# Altium schematic sheet mini.SchDoc
size A3
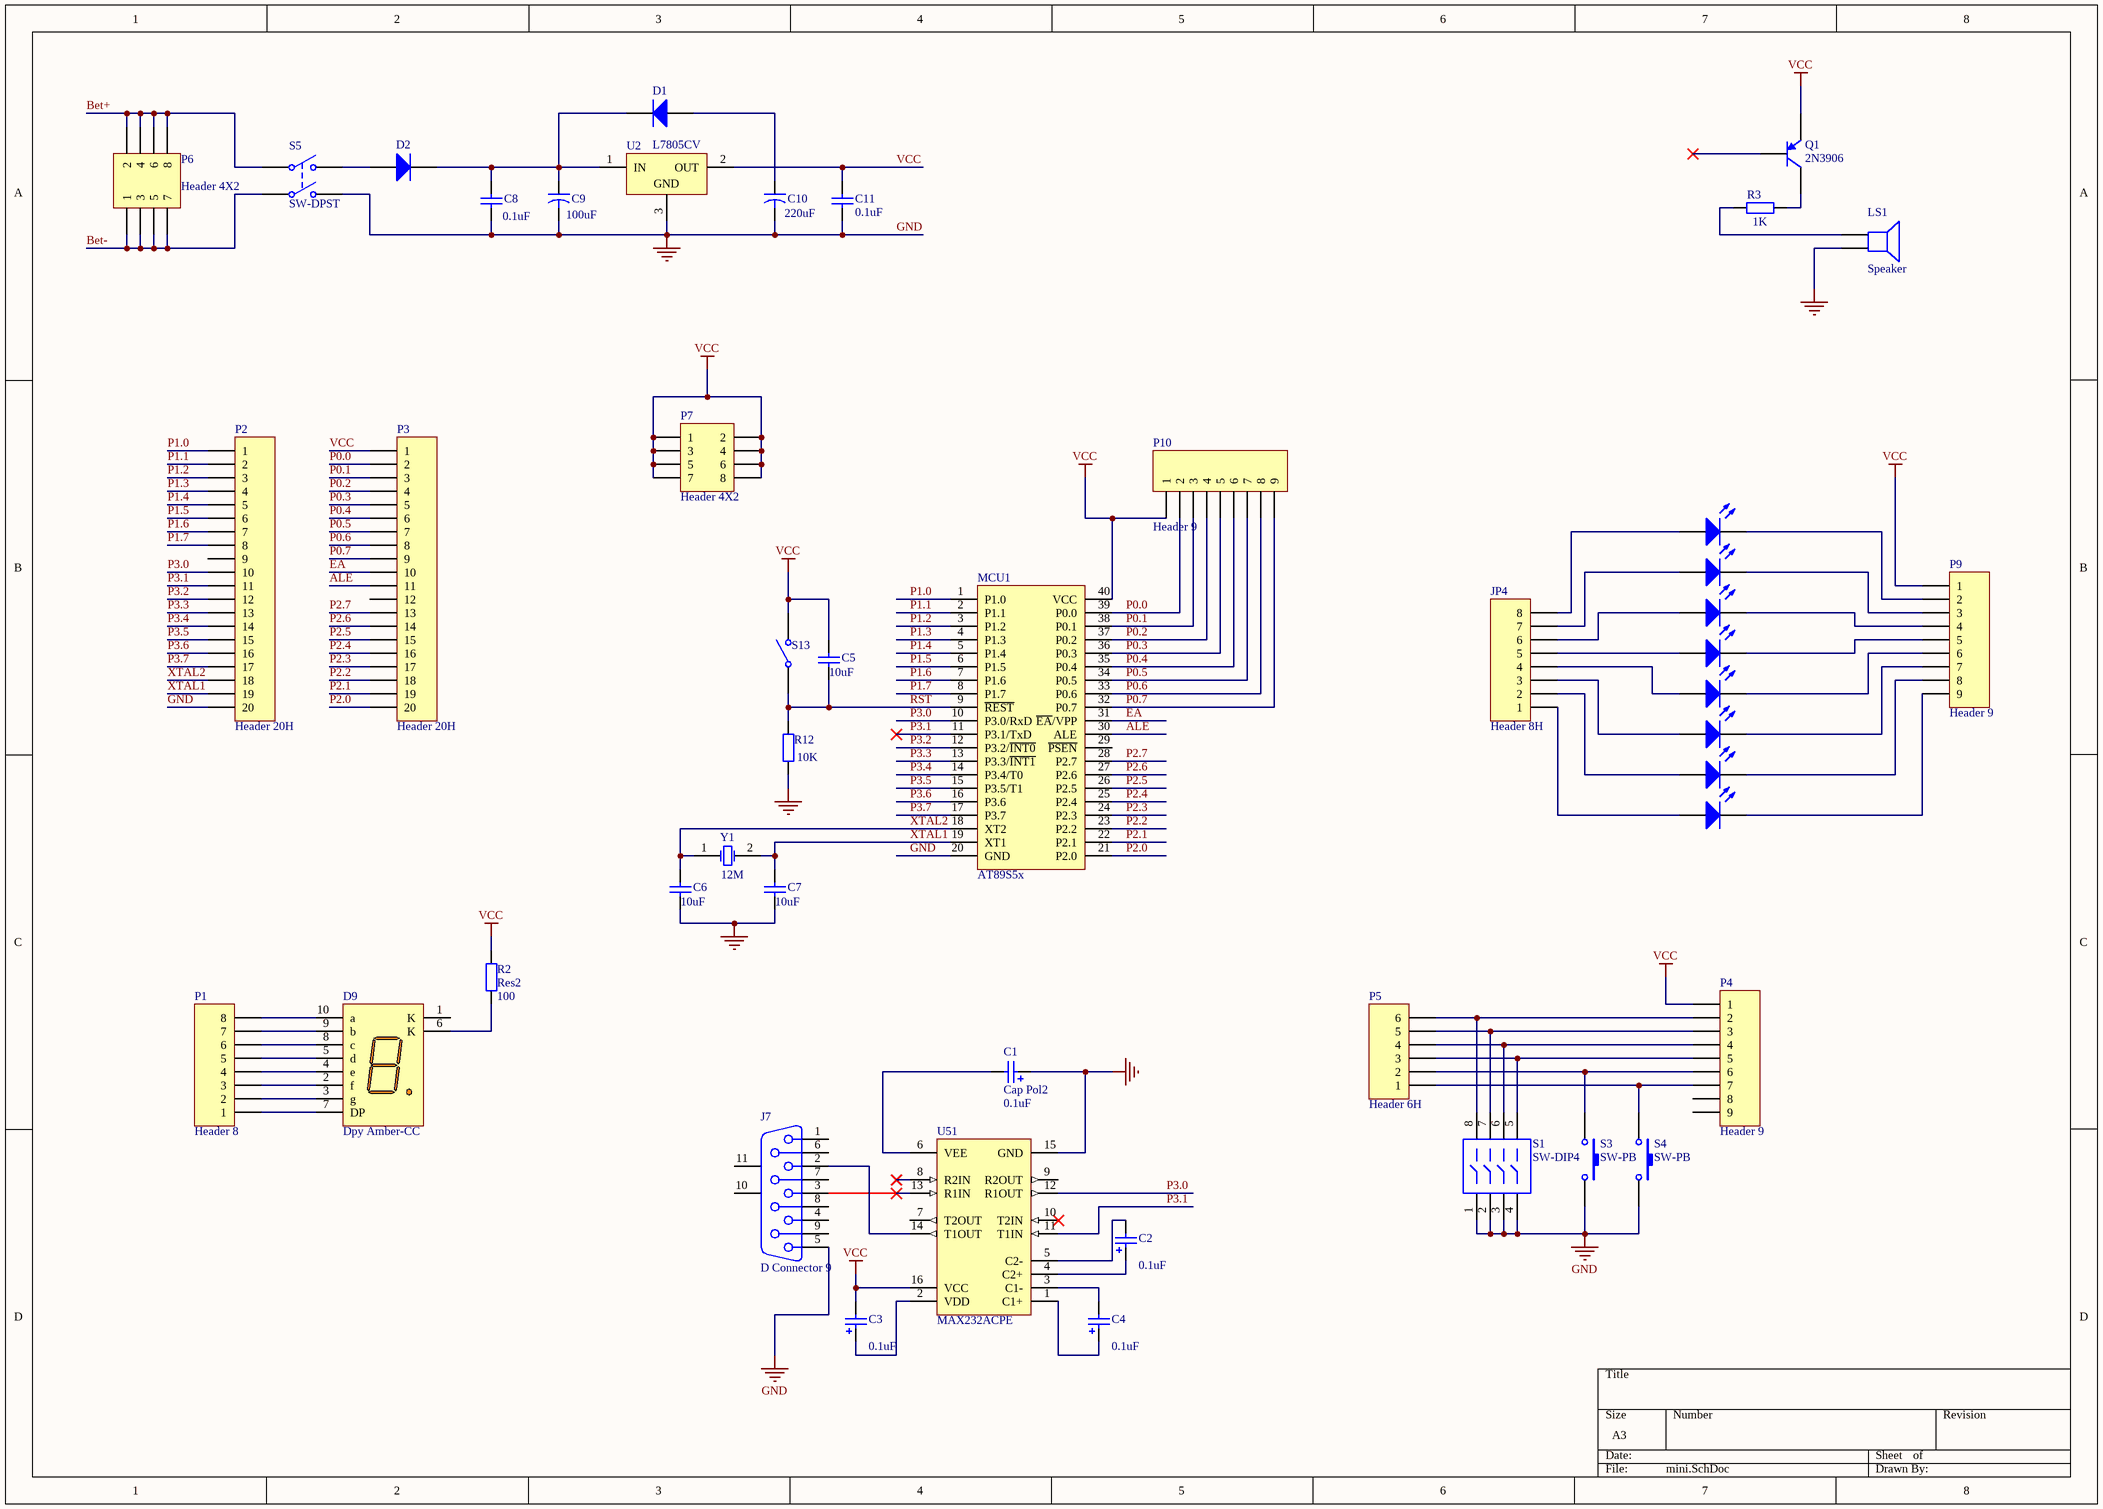
[diagram p0: mini.SchDoc]

## Parts
C1  Cap Pol2  value 0.1uF  [POLAR0.8]
C2  value 0.1uF  [POLAR0.8]  (hidden comment: Cap Pol2)
C3  value 0.1uF  [POLAR0.8]  (hidden comment: Cap Pol2)
C4  value 0.1uF  [POLAR0.8]  (hidden comment: Cap Pol2)
C5  value 10uF  [CC 2.2*5]  (hidden comment: Cap)
C6  value 10uF  [RAD-0.3]  (hidden comment: Cap)
C7  value 10uF  [RAD-0.3]  (hidden comment: Cap)
C8  value 0.1uF  [RAD-0.3]  (hidden comment: Cap)
C9  value 100uF  [CAPR5-4X5]  (hidden comment: Cap2)
C10  value 220uF  [CAPR5-4X5]  (hidden comment: Cap2)
C11  value 0.1uF  [RAD-0.3]  (hidden comment: Cap)
D1  Diode 1N4007  [DIODE-0.4]  (value not drawn)
D2  Diode 1N4148  [DIODE-0.4]  (value not drawn)
D9  Dpy Amber-CC  [H]
DS11  LED0  [PIN2]  (value not drawn)
DS12  LED0  [PIN2]  (value not drawn)
DS13  LED0  [PIN2]  (value not drawn)
DS14  LED0  [PIN2]  (value not drawn)
DS15  LED0  [PIN2]  (value not drawn)
DS16  LED0  [PIN2]  (value not drawn)
DS17  LED0  [PIN2]  (value not drawn)
DS18  LED0  [PIN2]  (value not drawn)
J7  D Connector 9  [DSUB1.385-2H9]
JP4  Header 8H  [HDR1X8H]
LS1  Speaker  [BEEP 7.6X12X7.5]
MCU1  AT89S5x  [DIP40]
P1  Header 8  [HDR1X8]
P2  Header 20H  [HDR1X20]
P3  Header 20H  [HDR1X20]
P4  Header 9  [HDR1X9]
P5  Header 6H  [HDR1X6H]
P6  Header 4X2  [HDR2X4]
P7  Header 4X2  [HDR2X4]
P9  Header 9  [HDR1X9]
P10  Header 9  [HDR1X9]
Q1  2N3906  [BCY-W3/E4]
R2  Res2  value 100  [AXIAL-0.4]
R3  value 1K  [AXIAL-0.4]  (hidden comment: Res2)
R12  value 10K  [AXIAL-0.4]  (hidden comment: Res2)
S1  SW-DIP4  [DIP-8]
S3  SW-PB  [SPST-2]
S4  SW-PB  [SPST-2]
S5  SW-DPST  [DPST-4]
S13  SW-SPST  [SPST-2]  (value not drawn)
U2  L7805CV  [D2PAK_N]
U51  MAX232ACPE  [DIP-16]
Y1  value 12M  [BEEP 7.6X12X7.5]  (hidden comment: XTAL)

## Nets
GND: C1.1 C6.1 C7.1 C8.1 C9.2 C10.2 C11.1 J7.5 LS1.2 MCU1.20(GND) P2.20 R12.1 S1.1 S1.2 S1.3 S1.4 S3.2 S4.2 S5.4(NO2) U2.3(GND) U51.15(GND)
VCC: C3.2 C5.2 C11.2 MCU1.40(VCC) P3.1 P4.1 P7.1 P7.2 P7.3 P7.4 P7.5 P7.6 P7.7 P7.8 P9.1 P10.1 Q1.1(E) R2.1 S13.2(NO) U2.2(OUT) U51.16(VCC)
ALE: MCU1.30(ALE) P3.11
Bet+: P6.2 P6.4 P6.6 P6.8 S5.1(COMMON1)
Bet-: P6.1 P6.3 P6.5 P6.7 S5.3(COMMON2)
~{EA}: MCU1.31(~{EA}/VPP) P3.10
P0.0: MCU1.39(P0.0) P3.2 P10.2
P0.1: MCU1.38(P0.1) P3.3 P10.3
P0.2: MCU1.37(P0.2) P3.4 P10.4
P0.3: MCU1.36(P0.3) P3.5 P10.5
P0.4: MCU1.35(P0.4) P3.6 P10.6
P0.5: MCU1.34(P0.5) P3.7 P10.7
P0.6: MCU1.33(P0.6) P3.8 P10.8
P0.7: MCU1.32(P0.7) P3.9 P10.9
P1.0: MCU1.1(P1.0) P2.1
P1.1: MCU1.2(P1.1) P2.2
P1.2: MCU1.3(P1.2) P2.3
P1.3: MCU1.4(P1.3) P2.4
P1.4: MCU1.5(P1.4) P2.5
P1.5: MCU1.6(P1.5) P2.6
P1.6: MCU1.7(P1.6) P2.7
P1.7: MCU1.8(P1.7) P2.8
P2.0: MCU1.21(P2.0) P3.20
P2.1: MCU1.22(P2.1) P3.19
P2.2: MCU1.23(P2.2) P3.18
P2.3: MCU1.24(P2.3) P3.17
P2.4: MCU1.25(P2.4) P3.16
P2.5: MCU1.26(P2.5) P3.15
P2.6: MCU1.27(P2.6) P3.14
P2.7: MCU1.28(P2.7) P3.13
P3.0: MCU1.10(P3.0/RxD) P2.10 U51.12(R1OUT)
P3.1: MCU1.11(P3.1/TxD) P2.11 U51.11(T1IN)
P3.2: MCU1.12(P3.2/~{INT0}) P2.12
P3.3: MCU1.13(P3.3/~{INT1}) P2.13
P3.4: MCU1.14(P3.4/T0) P2.14
P3.5: MCU1.15(P3.5/T1) P2.15
P3.6: MCU1.16(P3.6) P2.16
P3.7: MCU1.17(P3.7) P2.17
~{RST}: C5.1 MCU1.9(~{REST}) R12.2 S13.1(COMMON)
XTAL1: C7.2 MCU1.19(XT1) P2.19 Y1.2(OSC2)
XTAL2: C6.2 MCU1.18(XT2) P2.18 Y1.1(OSC1)
NetC1_2: C1.2 U51.6(VEE)
NetC2_1: C2.1 U51.4(C2+)
NetC2_2: C2.2 U51.5(C2-)
NetC3_1: C3.1 U51.2(VDD)
NetC4_1: C4.1 U51.1(C1+)
NetC4_2: C4.2 U51.3(C1-)
NetC8_2: C8.2 C9.1 D1.2(K) D2.2(K) U2.1(IN)
NetC10_1: C10.1 D1.1(A)
NetD2_1: D2.1(A) S5.2(NO1)
NetD9_2: D9.2(f) P1.3
NetD9_3: D9.3(g) P1.2
NetD9_4: D9.4(e) P1.4
NetD9_5: D9.5(d) P1.5
NetD9_6: D9.6(K) R2.2
NetD9_7: D9.7(DP) P1.1
NetD9_8: D9.8(c) P1.6
NetD9_9: D9.9(b) P1.7
NetD9_10: D9.10(a) P1.8
NetDS11_1: DS11.1(A) JP4.8
NetDS11_2: DS11.2(K) P9.2
NetDS12_1: DS12.1(A) JP4.7
NetDS12_2: DS12.2(K) P9.3
NetDS13_1: DS13.1(A) JP4.6
NetDS13_2: DS13.2(K) P9.4
NetDS14_1: DS14.1(A) JP4.5
NetDS14_2: DS14.2(K) P9.5
NetDS15_1: DS15.1(A) JP4.4
NetDS15_2: DS15.2(K) P9.6
NetDS16_1: DS16.1(A) JP4.3
NetDS16_2: DS16.2(K) P9.7
NetDS17_1: DS17.1(A) JP4.2
NetDS17_2: DS17.2(K) P9.8
NetDS18_1: DS18.1(A) JP4.1
NetDS18_2: DS18.2(K) P9.9
NetJ7_2: J7.2 U51.14(T1OUT)
NetLS1_1: LS1.1 R3.1
NetP4_2: P4.2 P5.6 S1.8
NetP4_3: P4.3 P5.5 S1.7
NetP4_4: P4.4 P5.4 S1.6
NetP4_5: P4.5 P5.3 S1.5
NetP4_6: P4.6 P5.2 S3.1
NetP4_7: P4.7 P5.1 S4.1
NetQ1_3: Q1.3(C) R3.2

Not connected (* = marked no-connect by the designer): D9 1(K); J7 1 3 4 6 7 8 9 10(MH1) 11(MH2); MCU1 29(~{PSEN}); P2 9; P3 12; P4 8 9; Q1 2(B)*; U51 7(T2OUT) 8(R2IN)* 9(R2OUT) 10(T2IN)* 13(R1IN)*

## Library data of the parts
C1-C4 = Cap Pol2: Polarized Capacitor (Axial); Published: 8-Jun-2000; LatestRevisionDate: 17-Jul-2002; LatestRevisionNote: Re-released for DXP Platform.; Publisher: Altium Limited
C5-C8 C11 = Cap: Capacitor; Published: 8-Jun-2000; LatestRevisionDate: 17-Jul-2002; LatestRevisionNote: Re-released for DXP Platform.; Publisher: Altium Limited
C9 C10 = Cap2: Capacitor; Published: 23-Sep-2002; Publisher: Altium Limited
D1 = Diode 1N4007: 1 Amp General Purpose Rectifier; Published: 8-Jun-2000; LatestRevisionDate: 17-Jul-2002; LatestRevisionNote: Re-released for DXP Platform.; DatasheetDocument: 1998; PackageDocument: Aug-1999; PackageReference: DO-41; Publisher: Altium Limited; Code_JEDEC: DO-204-AL
D2 = Diode 1N4148: High Conductance Fast Diode; Published: 8-Jun-2000; LatestRevisionDate: 17-Jul-2002; LatestRevisionNote: Re-released for DXP Platform.; DatasheetDocument: 1997; PackageReference: DO-35; Publisher: Altium Limited; Code_JEDEC: DO-204-AH
D9 = Dpy Amber-CC: 7.6 mm Black Surface 7-Segment Display: CC, RH DP; Package Information: Latest Revision: 19-Feb-2002; Min. Intensity: 354 ucd; Note: IF = 5 mA; Colour: Orange; Note: Pins 1 and 6 are redundant Cathodes.; Datasheet: Latest Revision: 19-Feb-2002; Package Reference: A; Publisher: Altium Limited
DS11-DS18 = LED0: Typical INFRARED GaAs LED; Published: 8-Jun-2000; Publisher: Altium Limited
  DS11 DS12: Revision: July-2002: Re-released for DXP Platform.
  DS13-DS18: LatestRevisionDate: 17-Jul-2002; LatestRevisionNote: Re-released for DXP Platform.
J7 = D Connector 9: Receptacle Assembly, 9 Position, Right Angle; PackageDocument: O; Positions: 9; Published: 15-Jun-2001; LatestRevisionDate: 17-Jul-2002; LatestRevisionNote: Re-released for DXP Platform.; DatasheetDocument: 1-Sep-1999; PackageReference: 788750; Publisher: Altium Limited; Orientation: Right Angle; Gender: Receptacle
JP4 = Header 8H: Header, 8-Pin, Right Angle; Revision: 17-Jul-2002: Re-released for DXP Platform.; Publisher: Altium Limited
LS1 = Speaker: Loudspeaker; Published: 24-Mar-1999; LatestRevisionDate: 17-Jul-2002; LatestRevisionNote: Re-released for DXP Platform.; Publisher: Altium Limited
MCU1 = AT89S5x: 51单片机
P1 = Header 8: Header, 8-Pin; LatestRevisionDate: 17-Jul-2002; LatestRevisionNote: Re-released for DXP Platform.; Publisher: Altium Limited
P2 P3 = Header 20H: Header, 20-Pin, Right Angle; LatestRevisionDate: 17-Jul-2002; LatestRevisionNote: Re-released for DXP Platform.; Publisher: Altium Limited
P4 P9 P10 = Header 9: Header, 9-Pin; LatestRevisionDate: 17-Jul-2002; LatestRevisionNote: Re-released for DXP Platform.; Publisher: Altium Limited
P5 = Header 6H: Header, 6-Pin, Right Angle; LatestRevisionDate: 17-Jul-2002; LatestRevisionNote: Re-released for DXP Platform.; Publisher: Altium Limited
P6 P7 = Header 4X2: Header, 4-Pin, Dual row; LatestRevisionDate: 17-Jul-2002; LatestRevisionNote: Re-released for DXP Platform.; Publisher: Altium Limited
Q1 = 2N3906: PNP General Purpose Amplifier; Published: 8-Jun-2000; LatestRevisionDate: 15-Jan-2003; LatestRevisionNote: PCB Footprint 'BCY-W3/D4.7' replaced; DatasheetDocument: 1997; PackageReference: TO-92A; Publisher: Altium Limited; Code_JEDEC: TO-92A
R2 R3 R12 = Res2: Resistor; Published: 8-Jun-2000; LatestRevisionDate: 17-Jul-2002; LatestRevisionNote: Re-released for DXP Platform.; Publisher: Altium Limited
S1 = SW-DIP4: DIP Switch; Published: 24-Mar-1999; Revision: July-2002: Re-released for DXP Platform.; Publisher: Altium Limited
S3 S4 = SW-PB: Switch; Published: 24-Mar-1999; LatestRevisionDate: 17-Jul-2002; LatestRevisionNote: Re-released for DXP Platform.; Publisher: Altium Limited
S5 = SW-DPST: Double-Pole, Single-Throw Switch; Published: 24-Mar-1999; LatestRevisionDate: 17-Jul-2002; LatestRevisionNote: Re-released for DXP Platform.; Publisher: Altium Limited
S13 = SW-SPST: Single-Pole, Single-Throw Switch; Published: 24-Mar-1999; Revision: July-2002: Re-released for DXP Platform.; Publisher: Altium Limited
U2 = L7805CV: Positive Voltage Regulator; Note: Tab is connected to pin 3 (GND).; Published: 24-Aug-2001; LatestRevisionDate: 17-Jul-2002; LatestRevisionNote: Re-released for DXP Platform.; DatasheetDocument: Dec-1998; PackageDocument: Jun-1998; PackageReference: TO220ABN; Publisher: Altium Limited
U51 = MAX232ACPE: +5V Powered, Multi-Channel RS-232 Driver/Receiver; PackageDocument: 1997; Published: 16-Jan-2001; LatestRevisionDate: 17-Jul-2002; LatestRevisionNote: Re-released for DXP Platform.; PackageReference: PE16A; Publisher: Altium Limited; Code_JEDEC: MS-001-BB
Y1 = XTAL: Crystal Oscillator; Published: 8-Jun-2000; LatestRevisionDate: 17-Jul-2002; LatestRevisionNote: Re-released for DXP Platform.; Publisher: Altium Limited